# Altium schematic sheet Sheet2.SchDoc
size A4
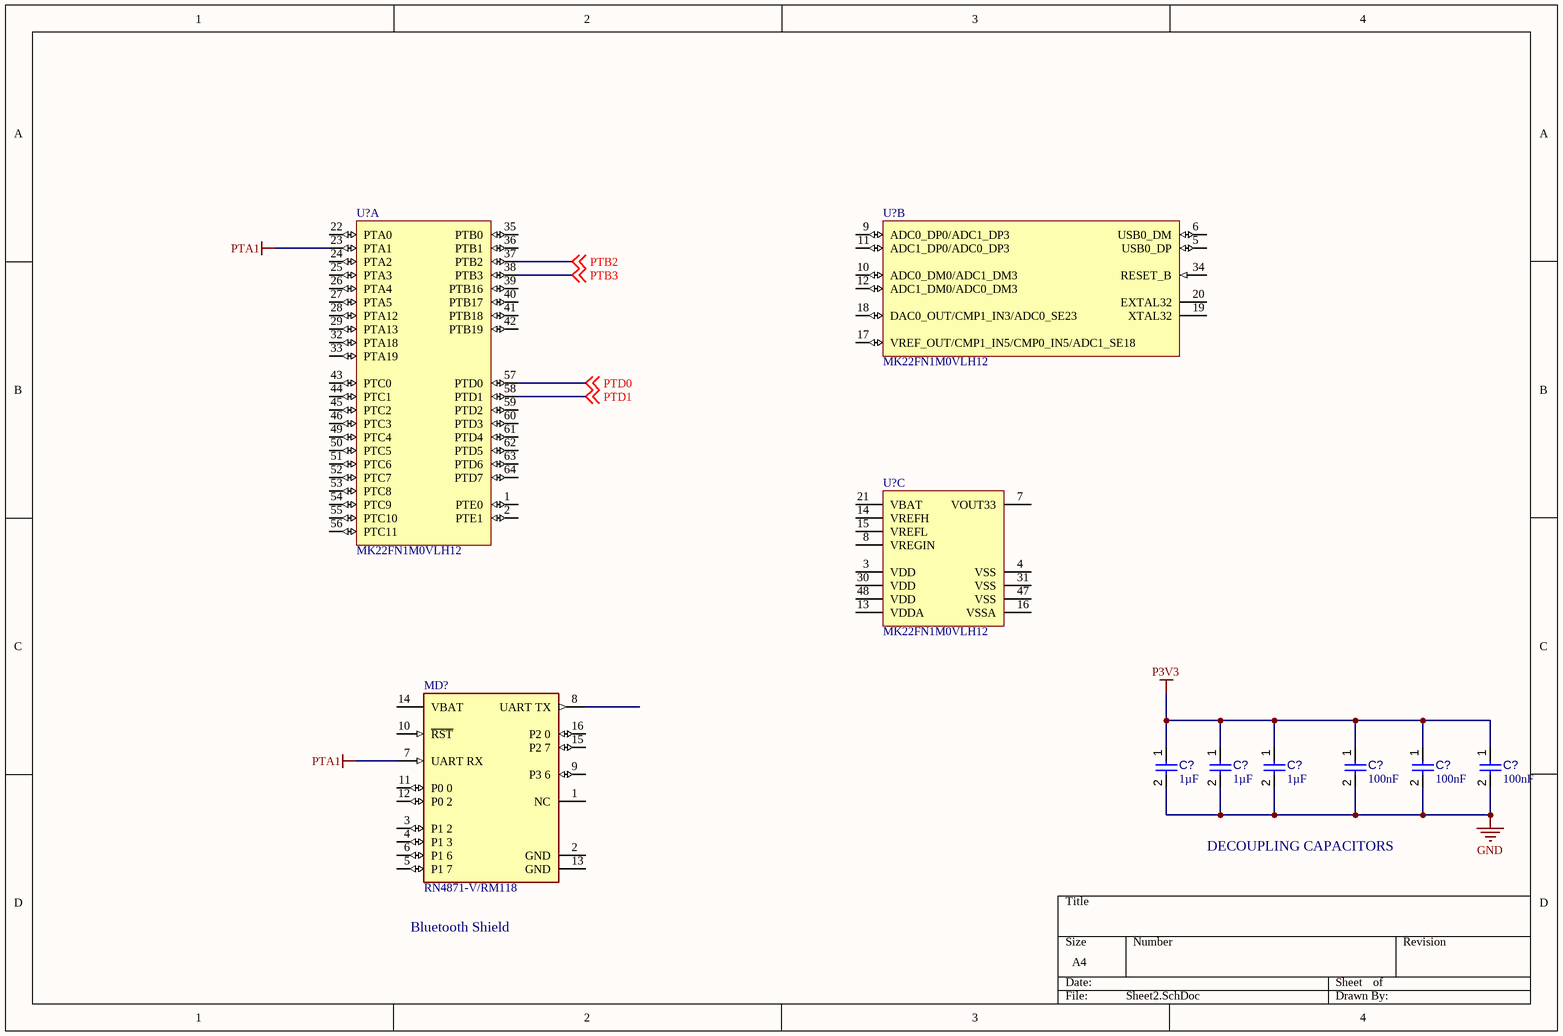
[diagram p0: Sheet2.SchDoc]

## Parts
(Parts that share a designator on the sheet are numbered #1, #2 ... from top to bottom, then left to right.)
C?#1  value 1µF  [CAPC0603(1608)100_L]  (hidden comment: Capacitor 1µF +/-40% 50V 0603)
C?#2  value 1µF  [CAPC0603(1608)100_L]  (hidden comment: Capacitor 1µF +/-40% 50V 0603)
C?#3  value 1µF  [CAPC0603(1608)100_L]  (hidden comment: Capacitor 1µF +/-40% 50V 0603)
C?#4  value 100nF  [CAPC0402(1005)60_L]  (hidden comment: Capacitor 100nF +/-20% 50V 0402)
C?#5  value 100nF  [CAPC0402(1005)60_L]  (hidden comment: Capacitor 100nF +/-20% 50V 0402)
C?#6  value 100nF  [CAPC0402(1005)60_L]  (hidden comment: Capacitor 100nF +/-20% 50V 0402)
MD?  RN4871-V/RM118  [FP-RN4871-V-RM118-MFG]
U?#1  MK22FN1M0VLH12  [FREE-LQFP-64_M]  (part A of 3)
U?#2  MK22FN1M0VLH12  [FREE-LQFP-64_M]  (part B of 3)
U?#3  MK22FN1M0VLH12  [FREE-LQFP-64_M]  (part C of 3)

## Nets
GND: C?#1.2 C?#2.2 C?#3.2 C?#4.2 C?#5.2 C?#6.2
P3V3: C?#1.1 C?#2.1 C?#3.1 C?#4.1 C?#5.1 C?#6.1
PTA1: MD?.7(UART_RX) U?#1.23(PTA1)
PTB2: U?#1.37(PTB2) ; off-sheet PTB2
PTB3: U?#1.38(PTB3) ; off-sheet PTB3
PTD0: U?#1.57(PTD0) ; off-sheet PTD0
PTD1: U?#1.58(PTD1) ; off-sheet PTD1

Not connected (* = marked no-connect by the designer): MD? 1(NC) 2(GND) 3(P1_2) 4(P1_3) 5(P1_7) 6(P1_6) 8(UART_TX) 9(P3_6) 10(~{RST}) 11(P0_0) 12(P0_2) 13(GND) 14(VBAT) 15(P2_7) 16(P2_0); U?#1 1(PTE0) 2(PTE1) 22(PTA0) 24(PTA2) 25(PTA3) 26(PTA4) 27(PTA5) 28(PTA12) 29(PTA13) 32(PTA18) 33(PTA19) 35(PTB0) 36(PTB1) 39(PTB16) 40(PTB17) 41(PTB18) 42(PTB19) 43(PTC0) 44(PTC1) 45(PTC2) 46(PTC3) 49(PTC4) 50(PTC5) 51(PTC6) 52(PTC7) 53(PTC8) 54(PTC9) 55(PTC10) 56(PTC11) 59(PTD2) 60(PTD3) 61(PTD4) 62(PTD5) 63(PTD6) 64(PTD7); U?#2 5(USB0_DP) 6(USB0_DM) 9(ADC0_DP0/ADC1_DP3) 10(ADC0_DM0/ADC1_DM3) 11(ADC1_DP0/ADC0_DP3) 12(ADC1_DM0/ADC0_DM3) 17(VREF_OUT/CMP1_IN5/CMP0_IN5/ADC1_SE18) 18(DAC0_OUT/CMP1_IN3/ADC0_SE23) 19(XTAL32) 20(EXTAL32) 34(RESET_B); U?#3 3(VDD) 4(VSS) 7(VOUT33) 8(VREGIN) 13(VDDA) 14(VREFH) 15(VREFL) 16(VSSA) 21(VBAT) 30(VDD) 31(VSS) 47(VSS) 48(VDD)

## Notes on the sheet
- DECOUPLING CAPACITORS
- (near MD?) Bluetooth Shield

## Library data of the parts
C?#1-C?#3 = CMP-001-00078-2: Chip Capacitor, 1µF +/-40%, 50V, 0603, Thickness 1 mm; Tolerance: 10%; Max Operating Temperature: 85°C; Voltage Rating: 50V; Pins: 2; Case/Package: 0402; Mounting Technology: SMT; Min Operating Temperature: -55°C
C?#4-C?#6 = CMP-001-00067-2: Chip Capacitor, 100nF +/-20%, 50V, 0402, Thickness 0.6 mm; Tolerance: 10%; Mounting Technology: SMT; Min Operating Temperature: -55°C; Pins: 2; Case/Package: 0402; Voltage Rating: 50V; Max Operating Temperature: 85°C
MD? = CMP-06331-000008-1: BLUETOOTH 5.0 BLE MODULE, SHIELD; Manufacturer: Microchip; Transmitting Current: 10mA; Interface: I2C,UART,Other; Data Rate: 10kbits/s; Min Supply Voltage: 1.9V; Number Of Gpio: 9; Bandwidth: 2.402-2.480GHz; Nominal Supply Current: 60-10000uA; Max Supply Voltage: 3.6V; Max Frequency: 2.480GHz; Sensitivity: -90dBm; Category: UNK; Temperature Range Low: -20°C; Device Class L1: Integrated Circuits (ICs); Lead Free: Yes; Digikey Description: BLUETOOTH 5.0 BLE MODULE, SHIELD; Automotive: No; Mouser Description: Bluetooth 4.2 Ble Module, Shielded, Antenna, Ascii Interface, 9X11.5Mm, 16 Module 11.5X9x2.1 Mm Tray; Receiving Current: 10mA; Temperature Range High: +70°C; RoHS: TRUE; Device Class L2: RF Semiconductors and Devices; Device Class L3: Transceivers; Temperature: -20°C to +70°C; ComponentLink2Description: Datasheet; ComponentLink2URL: http://ww1.microchip.com/downloads/en/DeviceDoc/RN4870-71-Bluetooth-Low-Energy-Module-Data-Sheet-DS50002489D.pdf; Package: RN4871-V/RM118; Manufacturer Part Number: RN4871-V/RM118; Height: 2.1mm; Octopart: https://octopart.com/rn4871-v%2Frm118-microchip-71237979
U?#1-U?#3 = CMP-020-00010-2: Kinetis K22F Sub-Family, 120 MHz ARM(R) Cortex(R)-M4-based Microcontroller with FPU, 1.71 to 3.6 V, -40 to 105 degC, 64-Pin LQFP, RoHS, Tray; Manufacturer: Freescale; Min Supply Voltage: 1.71V; Interface: UART; Density: 1MB; RAM Size: 128KB; Max Supply Voltage: 3.6V; Max Clock Frequency: 120MHz; Package Version: Rev. G, 01/2016; Manufacturer URL: http://www.nxp.com/; Packaging: Tray; RoHS Compliant: True; Pins: 64; Case/Package: LQFP; Package URL: http://cache.nxp.com/files/shared/doc/package_info/98ASS23234W.pdf?fsrch=1&sr=1&pageNum=1; Datasheet URL: http://cache.nxp.com/files/32bit/doc/data_sheet/K22P64M120SF5.pdf; Package Quantity: 160; Package Description: 64-Pin Low-profile Quad Flat Package, Body 10 x 10 mm, Pitch 0.5 mm; Mounting Technology: SM; Max Operating Temperature: 105°C; Package Reference: LQFP-64; Min Operating Temperature: -40°C; Datasheet Version: Rev. 4, 11/2014